# EAGLE design board exborgs baru (EAGLE 9.6.1)
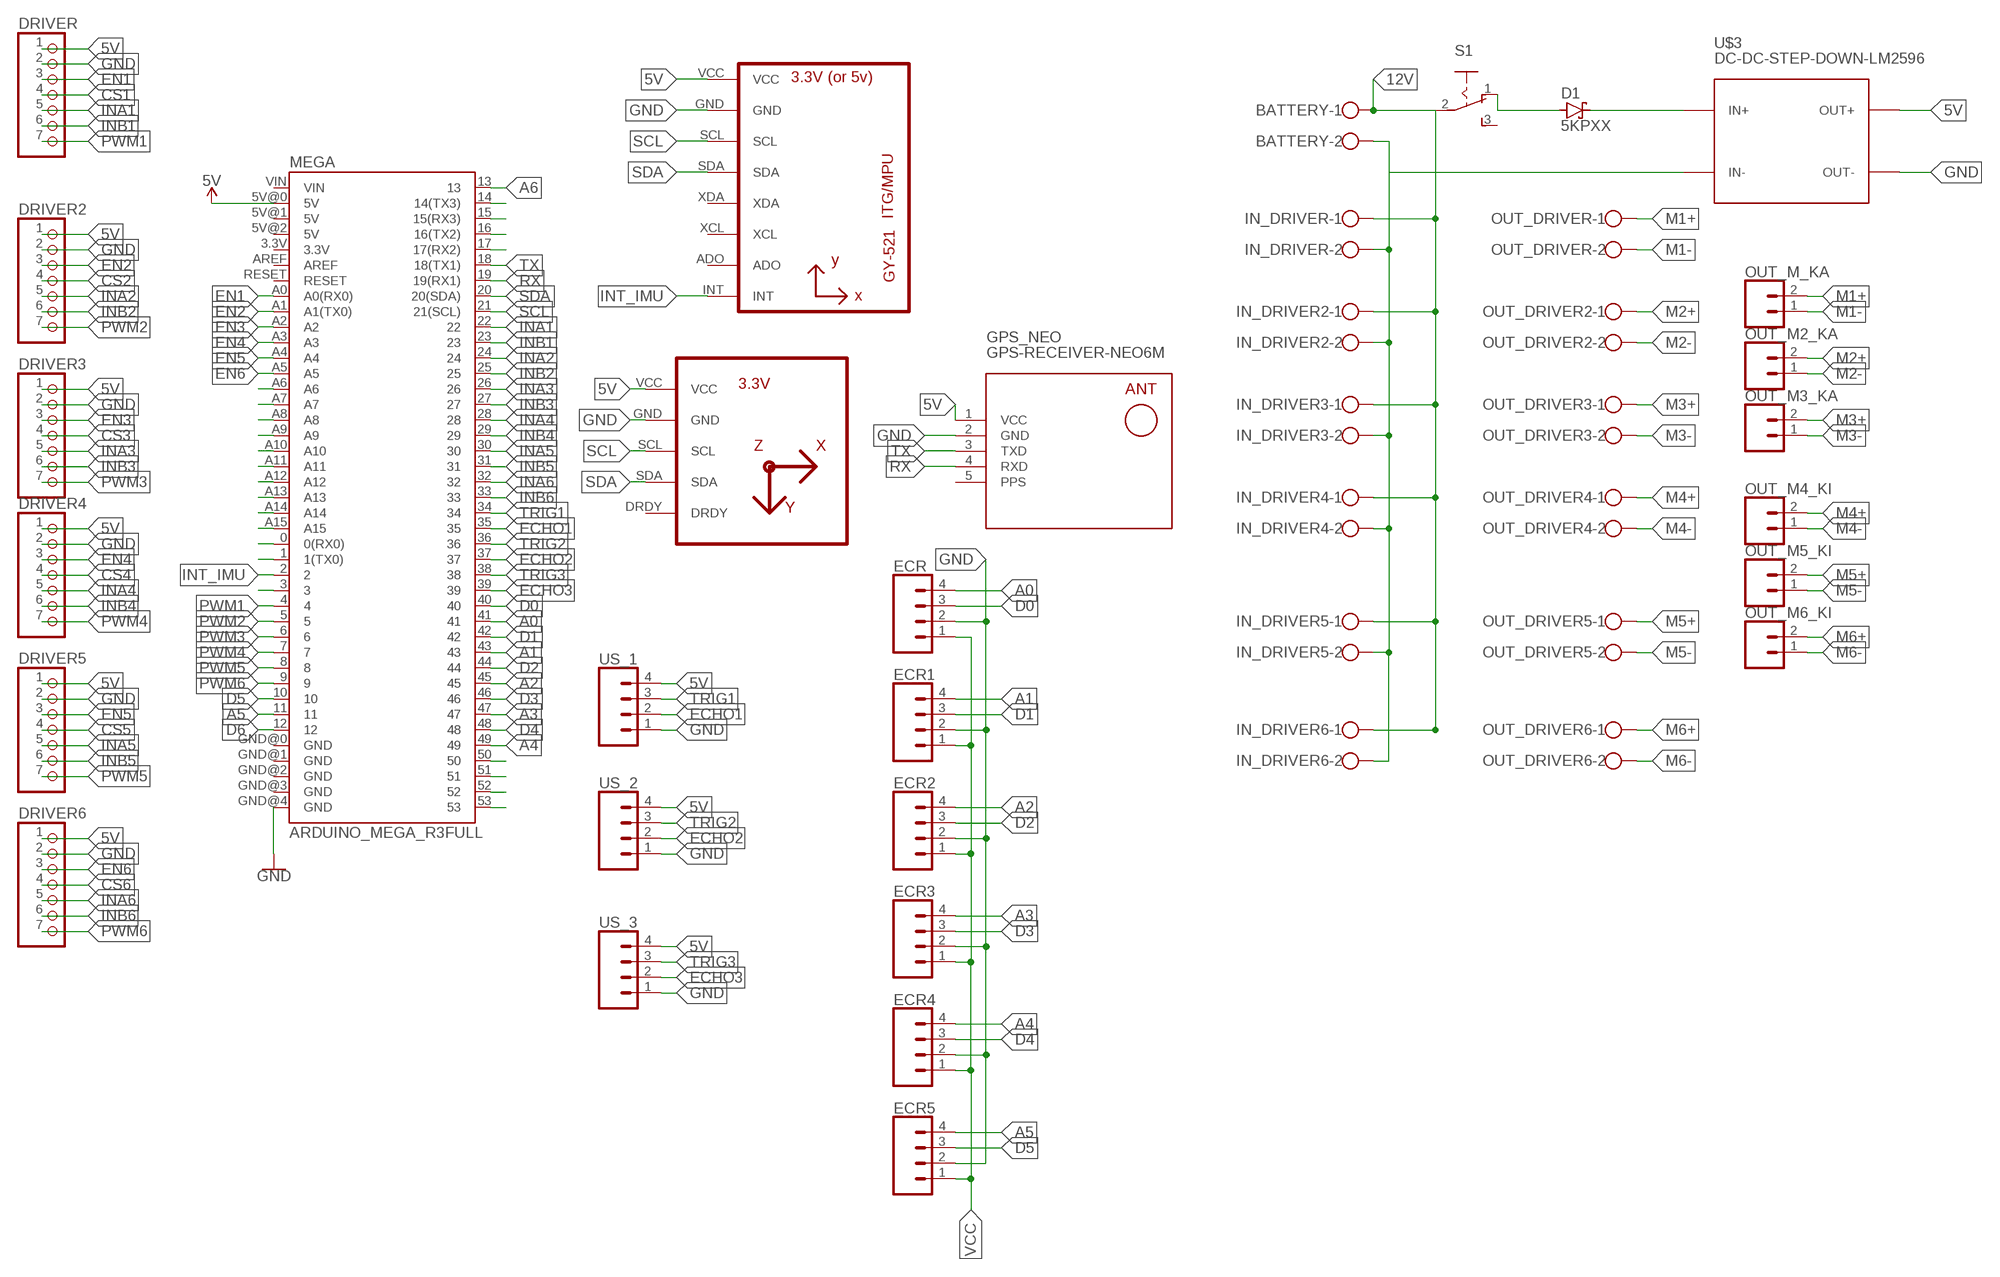
[diagram p0: schematic, sheet 1]

## Parts
BATTERY  W237-102  [W237-102]
D1  5KPXX  [P6T15]
DRIVER  PINHD-1X7  [1X07]
DRIVER2  PINHD-1X7  [1X07]
DRIVER3  PINHD-1X7  [1X07]
DRIVER4  PINHD-1X7  [1X07]
DRIVER5  PINHD-1X7  [1X07]
DRIVER6  PINHD-1X7  [1X07]
ECR  CONN_04POLAR  [MOLEX-1X4]
ECR1  CONN_04POLAR  [MOLEX-1X4]
ECR2  CONN_04POLAR  [MOLEX-1X4]
ECR3  CONN_04POLAR  [MOLEX-1X4]
ECR4  CONN_04POLAR  [MOLEX-1X4]
ECR5  CONN_04POLAR  [MOLEX-1X4]
GPS_NEO  GPS-RECEIVER-NEO6M  [GPS-RECEIVER-NEO6M]
IMU  GY-521MPU6050  [GY-521]
IN_DRIVER  W237-102  [W237-102]
IN_DRIVER2  W237-102  [W237-102]
IN_DRIVER3  W237-102  [W237-102]
IN_DRIVER4  W237-102  [W237-102]
IN_DRIVER5  W237-102  [W237-102]
IN_DRIVER6  W237-102  [W237-102]
KOMPAS  HMC5883LGY-271  [GY-271]
MEGA  ARDUINO_MEGA_R3FULL  [ARDUINO_MEGA]
OUT_DRIVER  W237-102  [W237-102]
OUT_DRIVER2  W237-102  [W237-102]
OUT_DRIVER3  W237-102  [W237-102]
OUT_DRIVER4  W237-102  [W237-102]
OUT_DRIVER5  W237-102  [W237-102]
OUT_DRIVER6  W237-102  [W237-102]
OUT_M2_KA  CONN_02POLAR  [MOLEX-1X2]
OUT_M3_KA  CONN_02POLAR  [MOLEX-1X2]
OUT_M4_KI  CONN_02POLAR  [MOLEX-1X2]
OUT_M5_KI  CONN_02POLAR  [MOLEX-1X2]
OUT_M6_KI  CONN_02POLAR  [MOLEX-1X2]
OUT_M_KA  CONN_02POLAR  [MOLEX-1X2]
S1  255SB  [255SB]
U$3  DC-DC-STEP-DOWN-LM2596  [DC-DC-STEP-DOWN-LM2596]
US_1  CONN_04POLAR  [MOLEX-1X4]
US_2  CONN_04POLAR  [MOLEX-1X4]
US_3  CONN_04POLAR  [MOLEX-1X4]

## Nets
5V: DRIVER2.1 DRIVER3.1 DRIVER4.1 DRIVER5.1 DRIVER6.1 DRIVER.1 GPS_NEO.1(VCC) IMU.VCC KOMPAS.VCC MEGA.5V@0(5V) U$3.OUT+ US_1.4 US_2.4 US_3.4
12V: BATTERY.1 IN_DRIVER2.1 IN_DRIVER3.1 IN_DRIVER4.1 IN_DRIVER5.1 IN_DRIVER6.1 IN_DRIVER.1 S1.2(P)
A0: ECR.4 MEGA.41
A1: ECR1.4 MEGA.43
A2: ECR2.4 MEGA.45
A3: ECR3.4 MEGA.47
A4: ECR4.4 MEGA.49
A5: ECR5.4 MEGA.11
A6: MEGA.13
CS1: DRIVER.4
CS2: DRIVER2.4
CS3: DRIVER3.4
CS4: DRIVER4.4
CS5: DRIVER5.4
CS6: DRIVER6.4
D0: ECR.3 MEGA.40
D1: ECR1.3 MEGA.42
D2: ECR2.3 MEGA.44
D3: ECR3.3 MEGA.46
D4: ECR4.3 MEGA.48
D5: ECR5.3 MEGA.10
D6: MEGA.12
ECHO1: MEGA.35 US_1.2
ECHO2: MEGA.37 US_2.2
ECHO3: MEGA.39 US_3.2
EN1: DRIVER.3 MEGA.A0(A0(RX0))
EN2: DRIVER2.3 MEGA.A1(A1(TX0))
EN3: DRIVER3.3 MEGA.A2
EN4: DRIVER4.3 MEGA.A3
EN5: DRIVER5.3 MEGA.A4
EN6: DRIVER6.3 MEGA.A5
GND: DRIVER2.2 DRIVER3.2 DRIVER4.2 DRIVER5.2 DRIVER6.2 DRIVER.2 ECR1.2 ECR2.2 ECR3.2 ECR4.2 ECR5.2 ECR.2 GPS_NEO.2(GND) IMU.GND KOMPAS.GND MEGA.GND@4(GND) U$3.OUT- US_1.1 US_2.1 US_3.1
INA1: DRIVER.5 MEGA.22
INA2: DRIVER2.5 MEGA.24
INA3: DRIVER3.5 MEGA.26
INA4: DRIVER4.5 MEGA.28
INA5: DRIVER5.5 MEGA.30
INA6: DRIVER6.5 MEGA.32
INB1: DRIVER.6 MEGA.23
INB2: DRIVER2.6 MEGA.25
INB3: DRIVER3.6 MEGA.27
INB4: DRIVER4.6 MEGA.29
INB5: DRIVER5.6 MEGA.31
INB6: DRIVER6.6 MEGA.33
INT_IMU: IMU.INT MEGA.2
M1+: OUT_DRIVER.1 OUT_M_KA.2
M1-: OUT_DRIVER.2 OUT_M_KA.1
M2+: OUT_DRIVER2.1 OUT_M2_KA.2
M2-: OUT_DRIVER2.2 OUT_M2_KA.1
M3+: OUT_DRIVER3.1 OUT_M3_KA.2
M3-: OUT_DRIVER3.2 OUT_M3_KA.1
M4+: OUT_DRIVER4.1 OUT_M4_KI.2
M4-: OUT_DRIVER4.2 OUT_M4_KI.1
M5+: OUT_DRIVER5.1 OUT_M5_KI.2
M5-: OUT_DRIVER5.2 OUT_M5_KI.1
M6+: OUT_DRIVER6.1 OUT_M6_KI.2
M6-: OUT_DRIVER6.2 OUT_M6_KI.1
N$1: MEGA.A6
N$2: D1.A S1.1(O)
N$3: D1.C U$3.IN+
N$4: BATTERY.2 IN_DRIVER2.2 IN_DRIVER3.2 IN_DRIVER4.2 IN_DRIVER5.2 IN_DRIVER6.2 IN_DRIVER.2 U$3.IN-
N$5: MEGA.A8
N$6: MEGA.A9
N$7: MEGA.A10
N$8: MEGA.A11
N$9: MEGA.A12
N$10: MEGA.A13
N$11: MEGA.A7
N$12: MEGA.A14
N$13: MEGA.A15
N$14: MEGA.0(0(RX0))
N$15: MEGA.1(1(TX0))
N$17: MEGA.3
N$28: MEGA.14(14(TX3))
N$29: MEGA.15(15(RX3))
N$30: MEGA.16(16(TX2))
N$31: MEGA.17(17(RX2))
N$62: MEGA.50
N$63: MEGA.51
N$64: MEGA.52
N$65: MEGA.53
PWM1: DRIVER.7 MEGA.4
PWM2: DRIVER2.7 MEGA.5
PWM3: DRIVER3.7 MEGA.6
PWM4: DRIVER4.7 MEGA.7
PWM5: DRIVER5.7 MEGA.8
PWM6: DRIVER6.7 MEGA.9
RX: GPS_NEO.4(RXD) MEGA.19(19(RX1))
SCL: IMU.SCL KOMPAS.SCL MEGA.21(21(SCL))
SDA: IMU.SDA KOMPAS.SDA MEGA.20(20(SDA))
TRIG1: MEGA.34 US_1.3
TRIG2: MEGA.36 US_2.3
TRIG3: MEGA.38 US_3.3
TX: GPS_NEO.3(TXD) MEGA.18(18(TX1))
VCC: ECR1.1 ECR2.1 ECR3.1 ECR4.1 ECR5.1 ECR.1
Unconnected: IMU.ADO IMU.XCL IMU.XDA KOMPAS.DRDY MEGA.3.3V MEGA.5V@1(5V) MEGA.5V@2(5V) MEGA.AREF MEGA.GND@0(GND) MEGA.GND@1(GND) MEGA.GND@2(GND) MEGA.GND@3(GND) MEGA.RESET MEGA.VIN S1.3(S)

## Power pins joined to a net without a drawn wire
PPS: GPS_NEO.5(PPS)

## Library data of the parts
BATTERY IN_DRIVER IN_DRIVER2-IN_DRIVER6 OUT_DRIVER OUT_DRIVER2-OUT_DRIVER6 = con-wago-500:W237-102: WAGO SCREW CLAMP; MPN: 237-102; OC_FARNELL: unknown; OC_NEWARK: 70K9898
D1 = diode:5KPXX: DIODE transient voltage suppressor
DRIVER DRIVER2-DRIVER6 = pinhead:PINHD-1X7: PIN HEADER
ECR ECR1-ECR5 US_1-US_3 = SparkFun-Connectors:CONN_04: Multi connection point. Often used as Generic Header-pin footprint for 0.1 inch spaced/style header connections On any of the 0.1 inch spaced packages, you can populate with these: Break Away Headers - Straight <https://www.sparkfun.com/products/116> (PRT-00116) Break Away Male Headers - Right Angle <https://www.sparkfun.com/products/553> (PRT-00553) Female Headers <https://www.sparkfun.com/products/115> (PRT-00115) Break Away Headers - Machine Pin <https://www.sparkfun.com/products/117> (PRT-00117) Break Away Female Headers - Swiss Machine Pin <https://www.sparkfun.com/products/743> (PRT-00743) For SCREWTERMINALS and SPRING TERMINALS visit here: Screw Terimnals on SparkFun.com <https://www.sparkfun.com/search/results?term=Screw+Terminals> (5mm/3.5mm/2.54mm spacing) This device is also useful as a general connection point to wire up your design to another part of your project. Our various solder wires solder well into these plated through hole pads. Hook-Up Wire - Assortment (Stranded, 22 AWG) <https://www.sparkfun.com/products/11375> (PRT-11375) Hook-Up Wire - Assortment (Solid Core, 22 AWG) <https://www.sparkfun.com/products/11367> (PRT-11367) View the entire wire category on our website here <https://www.sparkfun.com/categories/141> Special notes: Molex polarized connector foot print use with SKU : PRT-08231 with associated crimp pins and housings. 1MM SMD Version SKU: PRT-10208; PROD_ID: CONN-08186; SF_ID: PRT-08231
GPS_NEO = diy-modules:GPS-RECEIVER-NEO6M: GPS Receiver Module based on NEO-6 device Short tutorial how to use NEO-6 module with Arduino: http://www.xarg.org/2016/06/neo6mv2-gps-module-with-arduino/ NEO-6 datasheet is available here: https://www.u-blox.com/sites/default/files/products/documents/NEO-6_DataSheet_%28GPS.G6-HW-09005%29.pdf Click here to find device on ebay.com <http://www.ebay.com/sch/gyneo6mv2>
IMU = gy-521:GY-521
KOMPAS = hmc5883l:HMC5883L
MEGA = SparkFun-Boards:ARDUINO_MEGA_R3: Arduino Mega R3 ATmega2560 R3 compatible footprint. SparkFun Products: Arduino Mega 2560 R3 <https://www.sparkfun.com/products/11061>
OUT_M2_KA OUT_M3_KA OUT_M4_KI OUT_M5_KI OUT_M6_KI OUT_M_KA = SparkFun-Connectors:CONN_02: Multi connection point. Often used as Generic Header-pin footprint for 0.1 inch spaced/style header connections On any of the 0.1 inch spaced packages, you can populate with these: Break Away Headers - Straight <https://www.sparkfun.com/products/116> (PRT-00116) Break Away Male Headers - Right Angle <https://www.sparkfun.com/products/553> (PRT-00553) Female Headers <https://www.sparkfun.com/products/115> (PRT-00115) Break Away Headers - Machine Pin <https://www.sparkfun.com/products/117> (PRT-00117) Break Away Female Headers - Swiss Machine Pin <https://www.sparkfun.com/products/743> (PRT-00743) For SCREWTERMINALS and SPRING TERMINALS visit here: Screw Terimnals on SparkFun.com <https://www.sparkfun.com/search/results?term=Screw+Terminals> (5mm/3.5mm/2.54mm spacing) This device is also useful as a general connection point to wire up your design to another part of your project. Our various solder wires solder well into these plated through hole pads. Hook-Up Wire - Assortment (Stranded, 22 AWG) <https://www.sparkfun.com/products/11375> (PRT-11375) Hook-Up Wire - Assortment (Solid Core, 22 AWG) <https://www.sparkfun.com/products/11367> (PRT-11367) View the entire wire category on our website here <https://www.sparkfun.com/categories/141> Special notes: Molex polarized connector foot print use with: PRT-08233 with associated crimp pins and housings. 2.54_SCREWTERM for use with PRT-10571. 3.5mm Screw Terminal footprints for PRT-08084 5mm Screw Terminal footprints for use with PRT-08432; SF_ID: PRT-09918
S1 = switch:255SB: SLIDING SWITCH Distributor Buerklin, 11G810
U$3 = diy-modules:DC-DC-STEP-DOWN-LM2596: DC/DC Step-Down Regulator based on LM2596-ADJ chip LM2596 datasheet available here: http://www.ti.com/lit/ds/symlink/lm2596.pdf Click here to find device on ebay.com <http://www.ebay.com/sch/lm2596+power+regulator>

## Net classes
0 default: clearance 0.205 mm

## Board
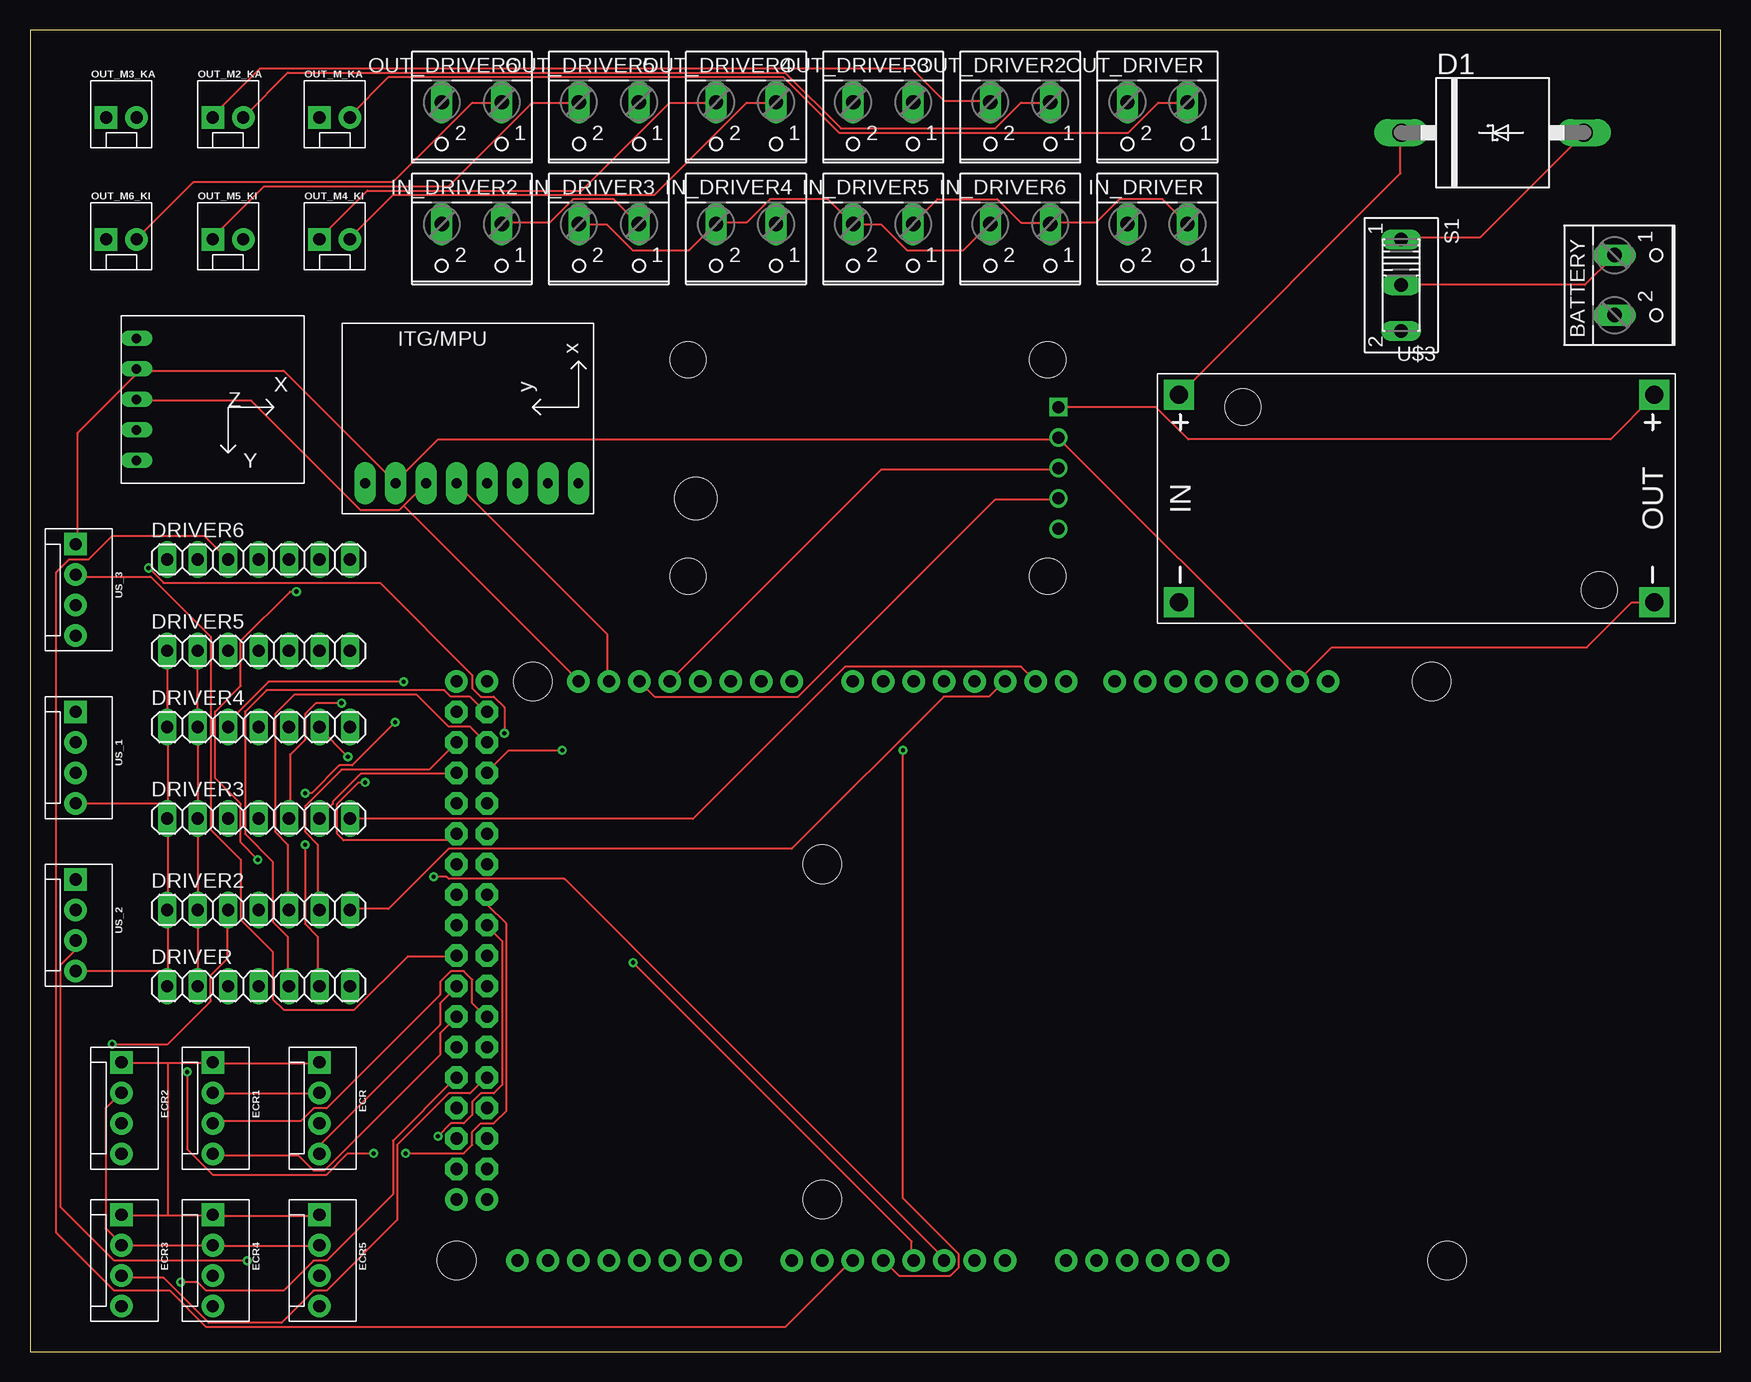
[diagram p1: board, top side]
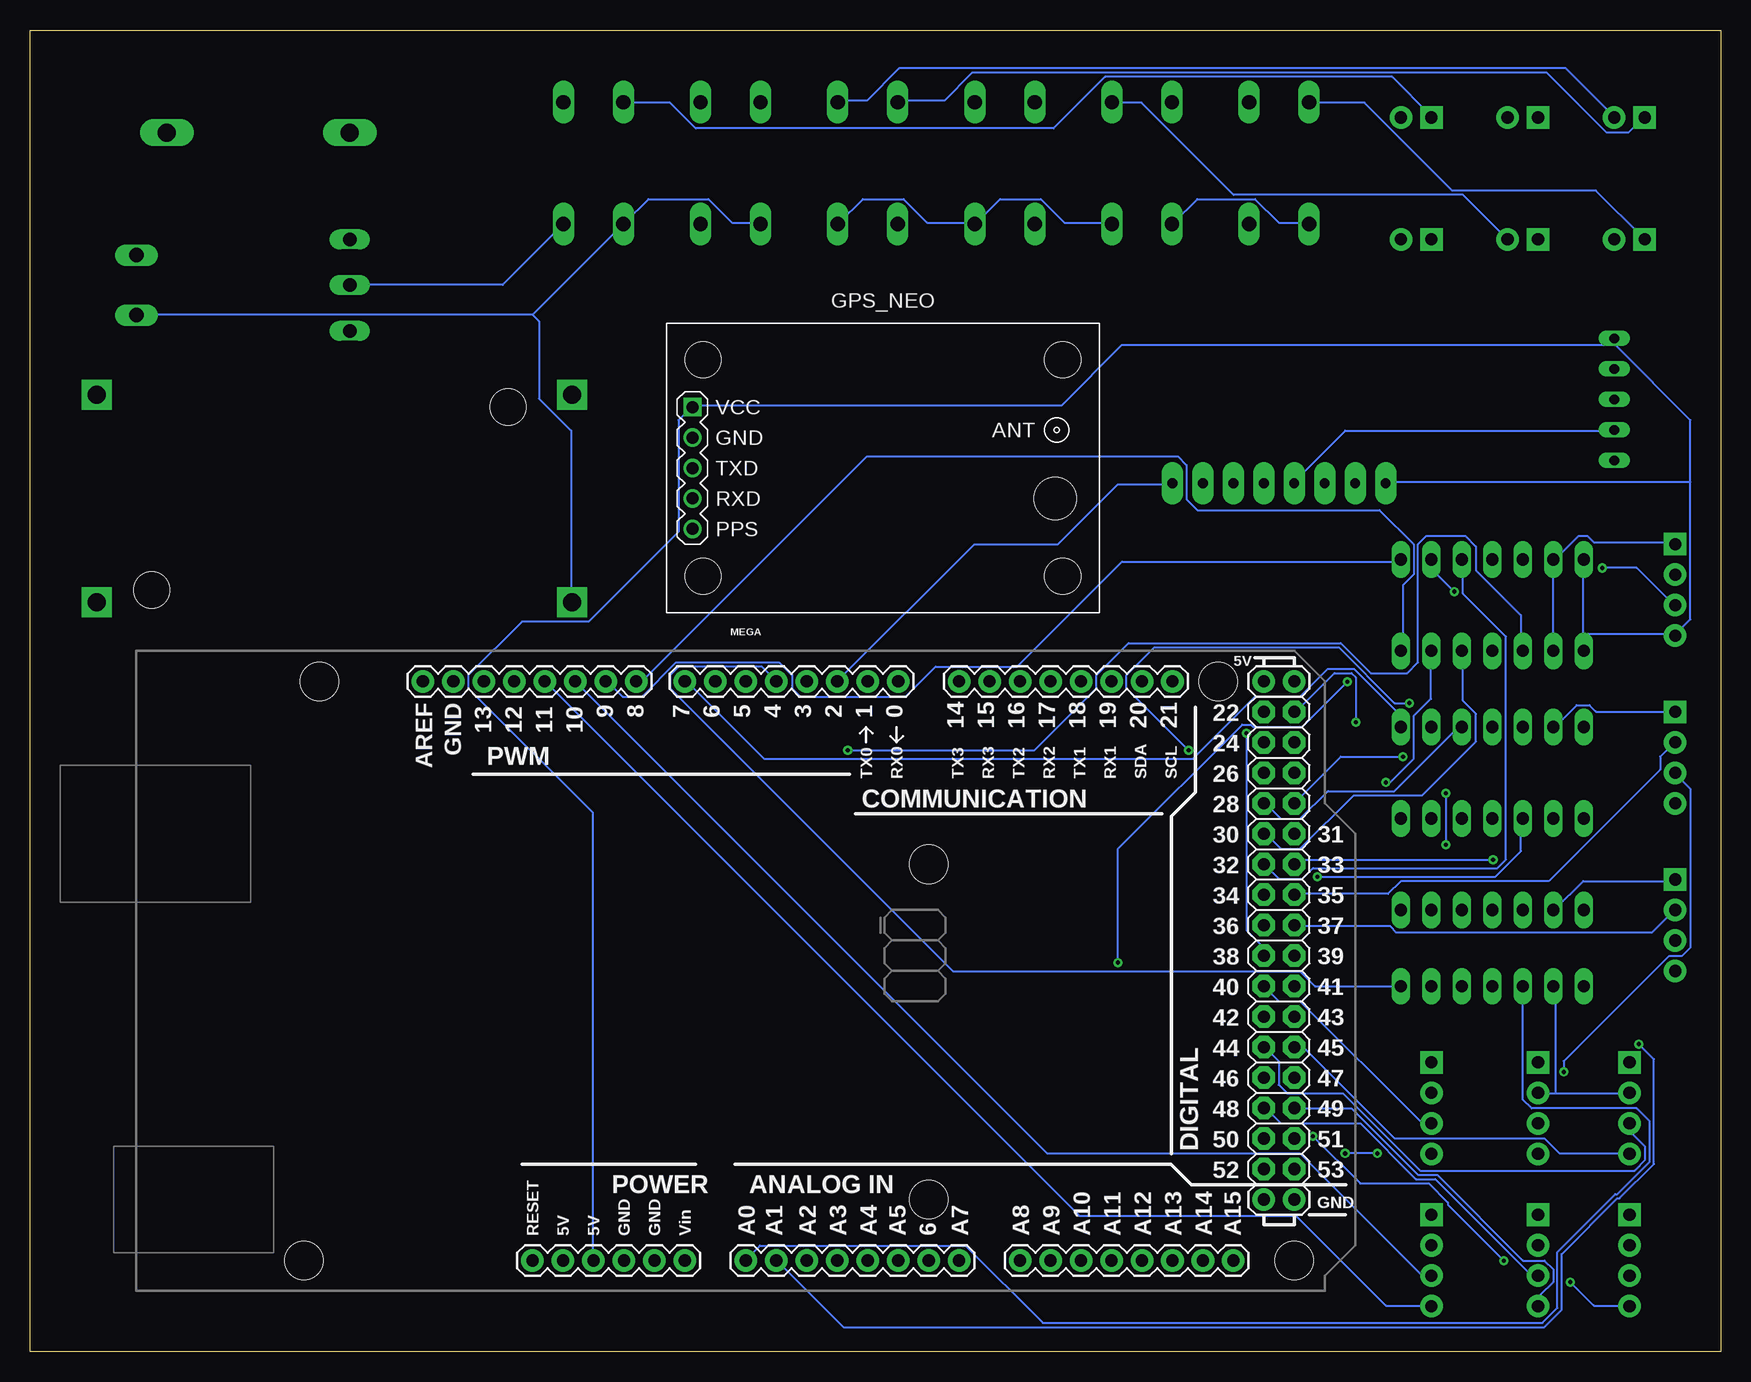
[diagram p2: board, bottom side, seen from below]

Size 140.95 x 110.16 mm. Coordinates in mm from the lower left corner, seen from the top.
Outline: 0,0 140.95,0 140.95,110.16 0,110.16 0,0
Copper layers (1*16): Top 0.035mm / dielectric 1.5mm / Bottom 0.035mm
Design rules "default": minimum track width 6mil, minimum drill 0.35mm, track to track 6mil, track to pad 6mil, pad to pad 6mil, via to via 6mil, smd to smd 6mil, copper to edge 40mil, drill to drill 6mil, minimum pad ring 10mil, minimum via ring 8mil, stop-mask expansion 4mil, vias tented up to drill 0mil, thermal gap 10mil

### Footprints (pad centres in the part's own frame; a part is rotated, then mirrored left to right if it is on the bottom)
W237-102 = drill 1.194 long: 1 -2.5,-1.27; 2 2.5,-1.27
P6T15 = drill 1.499 long: A 7.62,0; C -7.62,0
1X07 = drill 1.016 long: 1 -7.62,0; 2 -5.08,0; 3 -2.54,0; 4 0,0; 5 2.54,0; 6 5.08,0; 7 7.62,0
MOLEX-1X4 = drill 1.016 pad 1.88 square: 1 0,0 | drill 1.016 pad 1.88: 2 2.54,0; 3 5.08,0; 4 7.62,0
GPS-RECEIVER-NEO6M = drill 1 square: 1 -15.875,5.08 | drill 1: 2 -15.875,2.54; 3 -15.875,0; 4 -15.875,-2.54; 5 -15.875,-5.08 | hole 3: -14.986,9.017; -14.986,-9.017; 14.986,-9.017; 14.986,9.017 | hole 3.5: 14.351,-2.54
GY-521 = drill 0.8 pad 1.778 long: ADO -8.89,-6.35; GND -8.89,6.35; INT -8.89,-8.89; SCL -8.89,3.81; SDA -8.89,1.27; VCC -8.89,8.89; XCL -8.89,-3.81; XDA -8.89,-1.27
GY-271 = drill 0.8 long: DRDY -6.35,-4.445; GND -6.35,3.175; SCL -6.35,0.635; SDA -6.35,-1.905; VCC -6.35,5.715
ARDUINO_MEGA = drill 1.016 pad 1.88: 0 13.97,24.13; 1 11.43,24.13; 2 8.89,24.13; 3 6.35,24.13; 3.3V -13.97,-24.13; 4 3.81,24.13; 5 1.27,24.13; 5V@0 -11.43,-24.13; 5V@1 44.45,24.13; 5V@2 46.99,24.13; 6 -1.27,24.13; 7 -3.81,24.13; 8 -7.874,24.13; 9 -10.414,24.13; 10 -12.954,24.13; 11 -15.494,24.13; 12 -18.034,24.13; 13 -20.574,24.13; 14 19.05,24.13; 15 21.59,24.13; 16 24.13,24.13; 17 26.67,24.13; 18 29.21,24.13; 19 31.75,24.13; 20 34.29,24.13; 21 36.83,24.13; A0 1.27,-24.13; A1 3.81,-24.13; A2 6.35,-24.13; A3 8.89,-24.13; A4 11.43,-24.13; A5 13.97,-24.13; A6 16.51,-24.13; A7 19.05,-24.13; A8 24.13,-24.13; A9 26.67,-24.13; A10 29.21,-24.13; A11 31.75,-24.13; A12 34.29,-24.13; A13 36.83,-24.13; A14 39.37,-24.13; A15 41.91,-24.13; AREF -25.654,24.13; GND@0 -8.89,-24.13; GND@1 -6.35,-24.13; GND@2 44.45,-19.05; GND@3 46.99,-19.05; GND@4 -23.114,24.13; RESET -16.51,-24.13; VIN -3.81,-24.13 | drill 1.016 pad 1.88 octagon: 22 44.45,21.59; 23 46.99,21.59; 24 44.45,19.05; 25 46.99,19.05; 26 44.45,16.51; 27 46.99,16.51; 28 44.45,13.97; 29 46.99,13.97; 30 44.45,11.43; 31 46.99,11.43; 32 44.45,8.89; 33 46.99,8.89; 34 44.45,6.35; 35 46.99,6.35; 36 44.45,3.81; 37 46.99,3.81; 38 44.45,1.27; 39 46.99,1.27; 40 44.45,-1.27; 41 46.99,-1.27; 42 44.45,-3.81; 43 46.99,-3.81; 44 44.45,-6.35; 45 46.99,-6.35; 46 44.45,-8.89; 47 46.99,-8.89; 48 44.45,-11.43; 49 46.99,-11.43; 50 44.45,-13.97; 51 46.99,-13.97; 52 44.45,-16.51; 53 46.99,-16.51 | hole 3.2: -34.29,24.13; -35.56,-24.13; 16.51,8.89; 16.51,-19.05; 40.64,24.13; 46.99,-24.13
MOLEX-1X2 = drill 1.016 pad 1.88 square: 1 0,0 | drill 1.016 pad 1.88: 2 2.54,0
255SB = drill 1.118 long: 1 -3.81,0; 2 0,0; 3 3.81,0
DC-DC-STEP-DOWN-LM2596 = drill 1.5 pad 2.5 square: IN+ -19.812,8.636; IN- -19.812,-8.636; OUT+ 19.812,8.636; OUT- 19.812,-8.636 | hole 3: -14.478,7.62; 15.24,-7.62

### Placement (x,y rotation side)
BATTERY  133.35,88.9 270 top
D1  121.92,101.6 0 top
DRIVER  19.05,30.48 0 top
DRIVER2  19.05,36.83 0 top
DRIVER3  19.05,44.45 0 top
DRIVER4  19.05,52.07 0 top
DRIVER5  19.05,58.42 0 top
DRIVER6  19.05,66.04 0 top
ECR  24.13,24.13 270 top
ECR1  15.24,24.13 270 top
ECR2  7.62,24.13 270 top
ECR3  7.62,11.43 270 top
ECR4  15.24,11.43 270 top
ECR5  24.13,11.43 270 top
GPS_NEO  69.85,73.66 0 bottom
IMU  36.83,81.28 90 top
IN_DRIVER  93.98,92.71 180 top
IN_DRIVER2  36.83,92.71 180 top
IN_DRIVER3  48.26,92.71 180 top
IN_DRIVER4  59.69,92.71 180 top
IN_DRIVER5  71.12,92.71 180 top
IN_DRIVER6  82.55,92.71 180 top
KOMPAS  15.24,78.74 0 top
MEGA  82.55,31.75 0 bottom
OUT_DRIVER  93.98,102.87 180 top
OUT_DRIVER2  82.55,102.87 180 top
OUT_DRIVER3  71.12,102.87 180 top
OUT_DRIVER4  59.69,102.87 180 top
OUT_DRIVER5  48.26,102.87 180 top
OUT_DRIVER6  36.83,102.87 180 top
OUT_M2_KA  15.24,102.87 0 top
OUT_M3_KA  6.35,102.87 0 top
OUT_M4_KI  24.13,92.71 0 top
OUT_M5_KI  15.24,92.71 0 top
OUT_M6_KI  6.35,92.71 0 top
OUT_M_KA  24.13,102.87 0 top
S1  114.3,88.9 270 top
U$3  115.57,71.12 0 top
US_1  3.81,53.34 270 top
US_2  3.81,39.37 270 top
US_3  3.81,67.31 270 top

### Tracks (layer width: path | path; a pad name or v marks a point on that pad's centre or on a via)
5V
  Top 0.152: 11.49,31.73 11.49,36.74 DRIVER2.1 11.49,36.91 11.49,44.42 DRIVER3.1 | 11.49,31.73 11.49,30.48 DRIVER.1 11.49,31.73 | 11.49,31.73 3.98,31.73 US_2.4 | 11.49,45.67 11.49,51.93 DRIVER4.1 11.49,52.1 11.49,58.36 DRIVER5.1 | 11.49,45.67 11.49,44.6 DRIVER3.1 | 11.49,45.67 3.98,45.67 US_1.4 | 11.49,45.67 DRIVER3.1 | GPS_NEO.1 85.83,78.73 93.87,78.73 96.55,76.05 131.75,76.05 135.33,79.62 U$3.OUT+
  Bottom 0.152: 11.49,59.79 11.49,58.54 DRIVER5.1 11.49,59.79 | 11.49,59.79 11.49,65.86 DRIVER6.1 | 8.81,83.91 8.81,84.45 KOMPAS.VCC 8.81,83.91 | 8.81,83.91 2.55,77.66 2.55,72.48 | 2.55,72.48 2.55,61.04 3.8,59.79 US_3.4 3.98,59.79 11.49,59.79 | 2.55,72.48 27.93,72.48 IMU.VCC | MEGA.5V@0 94.05,7.79 94.05,44.96 104.41,55.32 104.41,56.39 99.94,60.86 94.41,60.86 86.9,68.37 86.9,77.66 85.83,78.73 GPS_NEO.1 85.65,78.91 54.91,78.91 49.91,83.91 8.81,83.91
12V
  Top 0.152: S1.2 114.42,88.92 129.61,88.92 131.93,91.24 BATTERY.1 | IN_DRIVER.1 96.37,94.1 94.41,96.06 90.83,96.06 88.87,94.1 85.11,94.1 IN_DRIVER6.1 84.93,94.1 82.61,94.1 80.65,96.06 75.64,96.06 73.68,94.1 IN_DRIVER5.1 | IN_DRIVER2.1 39.37,94.1 43.3,94.1 45.26,96.06 48.66,96.06 50.62,94.1 IN_DRIVER3.1
  Bottom 0.152: IN_DRIVER5.1 73.5,94.1 71.53,96.06 68.14,96.06 66.17,94.1 62.24,94.1 IN_DRIVER4.1 62.06,94.1 60.1,96.06 56.7,96.06 54.73,94.1 50.8,94.1 IN_DRIVER3.1 | S1.2 114.24,88.92 101.55,88.92 96.55,93.92 IN_DRIVER.1
A0
  Top 0.152: ECR.4 24.18,16.54 24.18,17.26 34.18,27.27 34.18,29.05 35.43,30.3 MEGA.41
A1
  Top 0.152: ECR1.4 15.24,16.36 22.39,16.36 23.64,15.11 24.53,15.11 34.18,24.76 34.18,26.55 35.43,27.8 MEGA.43
A2
  Bottom 0.152: ECR2.4 7.74,16.54 13.45,16.54 14.7,17.79 27.21,17.79 34.72,25.3 35.43,25.3 MEGA.45
A3  (via drill 0.35)
  Top 0.152: v12.56,5.82 13.99,5.82 14.7,5.11 21.14,5.11 23.64,7.61 24.71,7.61 30.25,13.15 30.25,17.62 35.43,22.8 MEGA.47
  Bottom 0.152: v12.56,5.82 10.59,3.86 7.74,3.86 ECR3.4
A4
  Bottom 0.152: ECR4.4 15.06,3.86 15.06,4.75 13.99,5.82 13.99,6.89 14.7,7.61 16.49,7.61 23.64,14.76 25.25,14.76 30.79,20.3 35.43,20.3 MEGA.49
A5
  Bottom 0.152: ECR5.4 24.18,3.86 27.93,3.86 35.43,11.36 53.48,11.36 97.98,55.86 MEGA.11
D0
  Bottom 0.152: ECR.3 24.18,19.22 25.07,19.22 35.08,29.23 36.86,29.23 37.94,30.3 MEGA.40
D1
  Top 0.152: ECR1.3 15.24,19.22 22.57,19.22 23.64,20.3 24.71,20.3 34.18,29.77 34.18,30.84 35.08,31.73 36.15,31.73 36.86,31.02 36.86,29.05 37.94,27.98 MEGA.42
D2
  Bottom 0.152: ECR2.3 7.56,19.05 7.56,18.33 6.31,17.08 6.31,16.01 7.2,15.11 25.07,15.11 31.5,21.55 36.15,21.55 36.86,22.26 36.86,24.23 37.94,25.3 MEGA.44
D3
  Top 0.152: ECR3.3 7.74,6.18 11.13,6.18 14.88,2.42 20.96,2.42 23.64,5.11 24.71,5.11 30.61,11 30.61,17.26 34.9,21.55 36.69,21.55 37.94,22.8 MEGA.46
D4
  Bottom 0.152: ECR4.3 15.78,6.36 23.82,14.4 25.43,14.4 30.07,19.05 36.69,19.05 37.94,20.3 MEGA.48
D5
  Bottom 0.152: ECR5.3 24.18,6.36 24.89,6.36 35.08,16.54 56.16,16.54 95.48,55.86 MEGA.10
ECHO1
  Bottom 0.152: MEGA.35 35.43,38.16 27.75,38.16 26.68,39.24 14.35,39.24 5.05,48.53 5.05,49.6 3.98,50.67 US_1.2
ECHO2
  Bottom 0.152: MEGA.37 35.43,35.48 27.57,35.48 27.03,34.95 5.77,34.95 3.98,36.74 US_2.2
ECHO3
  Top 0.152: MEGA.39 35.43,32.98 31.5,32.98 27.03,28.52 21.14,28.52 20.24,29.41 20.24,33.34 17.56,36.02 17.56,41.02 15.06,43.53 15.06,59.61 10.06,64.61 3.98,64.61 US_3.2
EN1
  Bottom 0.152: DRIVER.3 16.49,30.3 16.49,21.01 15.78,20.3 7.02,20.3 5.95,19.22 5.95,15.83 8.63,13.15 8.81,13.15 13.63,8.32 13.63,3.68 14.88,2.42 56.52,2.42 62.95,8.86 80.11,8.86 81.18,7.79 MEGA.A0
EN2  (via drill 0.35)
  Top 0.152: v6.84,25.66 11.49,25.66 15.06,29.23 15.06,31.38 16.49,32.8 16.49,36.74 DRIVER2.3
  Bottom 0.152: v6.84,25.66 5.59,24.41 5.59,15.65 8.45,12.79 8.63,12.79 13.28,8.14 13.28,3.5 14.7,2.07 73.14,2.07 78.68,7.61 MEGA.A1
EN3  (via drill 0.35)
  Top 0.152: v33.65,39.59 34.72,39.59 34.9,39.42 44.55,39.42 76.18,7.79 MEGA.A2
  Bottom 0.152: v33.65,39.59 18.81,39.59 16.67,41.74 16.67,44.42 DRIVER3.3
EN4  (via drill 0.35)
  Top 0.152: v31.15,55.86 19.89,55.86 16.67,52.64 16.67,52.1 DRIVER4.3 | v50.27,32.45 73.5,9.22 73.5,7.79 MEGA.A3
  Bottom 0.152: v31.15,55.86 34.9,52.1 39.01,52.1 39.19,52.28 39.9,52.28 50.27,41.92 v50.27,32.45
EN5  (via drill 0.35)
  Top 0.152: v72.78,50.14 72.78,12.79 77.43,8.14 77.43,7.07 76.71,6.36 72.43,6.36 71.17,7.61 MEGA.A4
  Bottom 0.152: v72.78,50.14 57.24,50.14 52.05,55.32 52.05,56.39 49.37,59.07 31.68,59.07 29.18,56.57 26.14,56.57 25.25,57.47 25.25,67.29 24.53,68.01 21.32,68.01 20.42,67.11 20.42,65.15 16.67,61.4 16.67,58.54 DRIVER5.3
EN6
  Top 0.152: DRIVER6.3 16.49,66.04 14.53,68.01 6.84,68.01 4.88,66.04 3.27,66.04 2.2,64.97 2.2,9.93 7.02,5.11 11.67,5.11 14.7,2.07 62.95,2.07 68.49,7.61 MEGA.A5
GND
  Top 0.152: 105.84,56.04 85.83,76.05 GPS_NEO.2 85.65,76.05 34.01,76.05 30.43,72.48 | 105.84,56.04 108.52,58.72 129.79,58.72 133.54,62.47 135.33,62.47 U$3.OUT- | 105.84,56.04 MEGA.GND@4 | US_3.1 3.98,67.47 3.98,76.59 8.81,81.41 8.81,81.77 KOMPAS.GND 8.99,81.77 21.14,81.77 30.43,72.48 | ECR5.2 24,8.86 15.24,8.86 ECR4.2 15.06,8.86 7.74,8.86 ECR3.2 7.56,9.04 6.31,10.29 6.31,20.3 7.56,21.55 ECR2.2 | ECR.2 24,21.55 15.24,21.55 ECR1.2 | DRIVER.2 13.99,30.48 13.99,36.74 DRIVER2.2 13.99,36.91 13.99,44.42 DRIVER3.2 13.99,44.6 13.99,51.93 DRIVER4.2 13.99,52.1 13.99,58.36 DRIVER5.2 | 30.43,72.48 IMU.GND
  Bottom 0.152: 13.81,21.55 15.06,21.55 ECR1.2 | 13.81,21.55 7.74,21.55 ECR2.2 | US_2.1 3.98,39.24 11.49,39.24 13.81,36.91 DRIVER2.2 | DRIVER5.2 13.99,58.54 13.99,65.86 DRIVER6.2 13.81,66.04 11.85,68.01 11.13,68.01 10.59,67.47 3.98,67.47 US_3.1 | US_1.1 3.98,53.36 10.42,53.36 10.95,53.89 12.02,53.89 13.81,52.1 DRIVER4.2 | 13.81,21.55 13.81,30.3 DRIVER.2
INA1
  Top 0.152: DRIVER.5 21.5,30.48 21.5,34.59 20.24,35.84 20.24,40.85 17.92,43.17 17.92,53.36 19.71,55.14 34.54,55.14 35.08,54.61 36.69,54.61 37.94,53.36 MEGA.22
INA2
  Top 0.152: DRIVER2.5 21.5,36.91 21.5,42.27 20.42,43.35 20.42,53.18 22.03,54.78 32.22,54.78 34.9,52.1 36.69,52.1 37.94,50.85 MEGA.24
INA3  (via drill 0.35)
  Top 0.152: v25.96,54.07 23.82,54.07 22.92,53.18 22.92,51.03 21.67,49.78 21.67,44.6 DRIVER3.5 | v44.37,50.14 39.9,50.14 38.12,48.35 MEGA.26
  Bottom 0.152: v25.96,54.07 27.21,54.07 31.86,58.72 47.23,58.72 49.55,56.39 49.55,55.32 v44.37,50.14
INA4
  Bottom 0.152: DRIVER4.5 21.67,51.93 22.03,51.93 27.21,46.74 32.75,46.74 35.08,44.42 36.69,44.42 37.94,45.67 MEGA.28
INA5
  Bottom 0.152: DRIVER5.5 21.5,58.36 21.5,54.25 20.42,53.18 20.42,50.85 24.89,46.39 30.61,46.39 35.08,41.92 36.69,41.92 37.94,43.17 MEGA.30
INA6
  Bottom 0.152: DRIVER6.5 21.5,65.86 21.5,63.18 17.92,59.61 17.92,41.02 18.64,40.31 34.01,40.31 34.9,39.42 36.86,39.42 37.94,40.49 MEGA.32
INB1  (via drill 0.35)
  Top 0.152: v22.92,42.27 22.92,35.66 24,34.59 24,30.48 DRIVER.6 | v22.92,46.56 23.46,46.56 25.78,48.89 26.86,48.89 v30.43,52.46
  Bottom 0.152: v22.92,46.56 v22.92,42.27 | v30.43,52.46 30.43,56.21 30.79,56.57 32.22,56.57 35.43,53.36 MEGA.23
INB2
  Top 0.152: MEGA.25 33.29,48.53 25.96,48.53 22.92,45.49 22.92,43.35 24,42.27 24,36.91 DRIVER2.6
INB3
  Top 0.152: DRIVER3.6 24.18,44.6 25.25,45.67 25.25,45.85 27.57,48.17 35.43,48.17 MEGA.27
INB4  (via drill 0.35)
  Top 0.152: v26.5,49.6 24.18,51.93 DRIVER4.6
  Bottom 0.152: v26.5,49.6 31.68,49.6 35.43,45.85 MEGA.29
INB5  (via drill 0.35)
  Top 0.152: v27.93,47.46 27.39,47.46 25.61,45.67 25.61,43.17 26.14,42.63 34.9,42.63 35.43,43.17 MEGA.31
  Bottom 0.152: v27.93,47.46 27.57,47.46 25.61,49.42 25.61,53 24.18,54.43 24.18,58.36 DRIVER5.6
INB6  (via drill 0.35)
  Top 0.152: v22.21,63.36 21.67,63.36 17.56,59.25 17.56,55.5 15.42,53.36 15.42,47.82 17.56,45.67 17.56,42.45 v18.99,41.02
  Bottom 0.152: v22.21,63.36 24,65.15 24,65.86 DRIVER6.6 | v18.99,41.02 35.08,41.02 35.43,40.67 MEGA.33
INT_IMU
  Bottom 0.152: IMU.INT 45.8,72.3 50.27,72.3 55.27,67.29 62.24,67.29 73.5,56.04 MEGA.2
M1+
  Top 0.152: OUT_DRIVER.1 96.37,104.11 94.05,104.11 91.55,101.6 67.42,101.6 62.78,106.25 29.9,106.25 26.68,103.03 OUT_M_KA.2
M1-
  Bottom 0.152: OUT_DRIVER.2 91.37,104.11 87.62,104.11 85.47,101.96 55.63,101.96 51.34,106.25 27.39,106.25 24.18,103.03 OUT_M_KA.1
M2+
  Top 0.152: OUT_DRIVER2.1 84.93,104.11 82.61,104.11 80.47,101.96 67.6,101.96 62.95,106.61 21.5,106.61 17.92,103.03 OUT_M2_KA.2
M2-
  Top 0.152: OUT_DRIVER2.2 79.93,104.28 76.18,104.28 73.5,106.97 19.17,106.97 15.24,103.03 OUT_M2_KA.1
M3+
  Bottom 0.152: OUT_DRIVER3.1 73.5,104.28 71.17,104.28 68.49,106.97 12.92,106.97 8.99,103.03 OUT_M3_KA.2
M3-
  Bottom 0.152: OUT_DRIVER3.2 68.49,104.28 64.74,104.28 62.42,106.61 14.53,106.61 9.52,101.6 7.74,101.6 6.48,102.86 OUT_M3_KA.1
M4+
  Top 0.152: OUT_DRIVER4.1 62.06,104.11 59.74,104.11 52.05,96.42 30.25,96.42 26.68,92.85 OUT_M4_KI.2
M4-
  Top 0.152: OUT_DRIVER4.2 57.06,104.11 53.3,104.11 45.98,96.78 28.11,96.78 24.18,92.85 OUT_M4_KI.1
M5+
  Bottom 0.152: OUT_DRIVER5.1 50.62,104.11 48.3,104.11 40.62,96.42 21.5,96.42 17.92,92.85 OUT_M5_KI.2
M5-
  Top 0.152: OUT_DRIVER5.2 45.62,104.11 41.87,104.11 34.9,97.14 19.53,97.14 15.24,92.85 OUT_M5_KI.1
M6+
  Top 0.152: OUT_DRIVER6.1 39.19,104.11 36.86,104.11 30.25,97.49 13.63,97.49 8.99,92.85 OUT_M6_KI.2
M6-
  Bottom 0.152: OUT_DRIVER6.2 34.18,104.11 29.72,104.11 22.39,96.78 10.42,96.78 6.48,92.85 OUT_M6_KI.1
N$2
  Top 0.152: S1.1 114.42,92.85 120.85,92.85 129.43,101.42 D1.A
N$3
  Top 0.152: D1.C 114.24,101.42 114.24,98.21 95.84,79.8 U$3.IN+
N$4
  Top 0.152: IN_DRIVER3.2 45.8,93.92 48.12,93.92 50.27,91.78 54.91,91.78 57.06,93.92 IN_DRIVER4.2 57.24,94.1 59.74,94.1 61.7,96.06 66.53,96.06 68.49,94.1 IN_DRIVER5.2 68.67,93.92 71,93.92 73.14,91.78 77.79,91.78 79.93,93.92 IN_DRIVER6.2
  Bottom 0.152: IN_DRIVER2.2 34.36,94.1 36.86,94.1 38.83,96.06 43.66,96.06 45.62,94.1 IN_DRIVER3.2 | 99.05,86.41 131.93,86.41 BATTERY.2 | 99.05,86.41 91.55,93.92 IN_DRIVER.2 91.37,94.1 89.4,96.06 84.4,96.06 82.43,94.1 80.11,94.1 IN_DRIVER6.2 | 99.05,86.41 98.51,85.88 98.51,79.45 95.84,76.77 95.84,62.65 U$3.IN-
PWM1
  Bottom 0.152: DRIVER.7 33.83,30.48 35.08,31.73 64.03,31.73 87.62,55.32 87.62,56.39 86.9,57.11 79.93,57.11 78.86,56.04 MEGA.4
PWM2
  Top 0.152: DRIVER2.7 26.68,36.91 29.9,36.91 34.9,41.92 63.49,41.92 76.18,54.61 79.93,54.61 81.18,55.86 MEGA.5
PWM3
  Top 0.152: DRIVER3.7 26.68,44.42 55.27,44.42 67.96,57.11 82.61,57.11 83.68,56.04 MEGA.6
PWM4
  Bottom 0.152: DRIVER4.7 26.68,52.1 26.68,53 30.61,56.93 32.75,56.93 35.08,54.61 38.83,54.61 44.01,49.42 79.75,49.42 86.19,55.86 MEGA.7
PWM5
  Bottom 0.152: DRIVER5.7 26.5,58.54 26.5,63.9 25.61,64.79 25.61,67.29 28.46,70.15 43.66,70.15 44.55,71.05 44.55,73.91 45.26,74.62 71.17,74.62 89.76,56.04 90.29,56.04 MEGA.8
PWM6
  Bottom 0.152: DRIVER6.7 26.68,65.86 49.91,65.86 58.66,57.11 65.46,57.11 67.96,54.61 76.71,54.61 77.43,55.32 77.43,56.39 78.5,57.47 87.08,57.47 89.94,54.61 91.55,54.61 92.8,55.86 MEGA.9
RX
  Top 0.152: GPS_NEO.4 85.65,71.05 80.47,71.05 64.03,54.61 52.05,54.61 50.8,55.86 MEGA.19
SCL
  Top 0.152: 31.15,70.51 32.93,72.3 IMU.SCL | 31.15,70.51 30.79,70.15 27.57,70.15 18.46,79.27 8.99,79.27 KOMPAS.SCL | 31.15,70.51 45.62,56.04 MEGA.21
SDA
  Top 0.152: MEGA.20 48.12,56.04 48.12,59.79 35.61,72.3 IMU.SDA
  Bottom 0.152: KOMPAS.SDA 8.99,76.77 31.32,76.77 35.61,72.48 IMU.SDA
TRIG1  (via drill 0.35)
  Top 0.152: v31.32,16.54 36.15,16.54 36.86,17.26 36.86,18.33 37.58,19.05 38.65,19.05 39.72,20.12 39.72,35.66 38.12,37.27 38.12,37.99 MEGA.34 | v28.64,16.54 26.5,16.54 24.71,14.76 15.24,14.76 13.1,16.9 v13.1,23.33
  Bottom 0.152: v28.64,16.54 v31.32,16.54 | v13.1,23.33 13.1,24.23 4.34,32.98 3.27,32.98 2.55,33.7 2.55,46.92 3.8,48.17 US_1.3
TRIG2  (via drill 0.35)
  Top 0.152: v18.1,7.61 7.02,7.61 2.55,12.08 2.55,32.27 3.8,33.52 3.8,34.23 US_2.3 | v34.01,17.97 35.08,19.05 36.15,19.05 36.86,19.76 36.86,20.83 37.58,21.55 38.65,21.55 39.37,22.26 39.37,34.23 38.12,35.48 MEGA.36
  Bottom 0.152: v18.1,7.61 22.75,12.25 22.75,12.43 24.35,14.04 30.07,14.04 v34.01,17.97
TRIG3  (via drill 0.35)
  Top 0.152: v39.54,51.57 39.54,53.71 38.65,54.61 37.58,54.61 36.86,55.32 36.86,56.39 29.18,64.08 11.13,64.08 v9.88,65.33
  Bottom 0.152: v39.54,51.57 39.54,35.13 38.12,33.7 38.12,33.16 MEGA.38 | v9.88,65.33 7.02,65.33 3.98,62.29 US_3.3
TX
  Top 0.152: GPS_NEO.3 85.65,73.55 71,73.55 53.48,56.04 MEGA.18
VCC
  Top 0.152: 11.49,11.36 15.06,11.36 ECR4.1 15.24,11.36 24,11.36 ECR5.1 | 11.49,11.36 7.74,11.36 ECR3.1 | 11.49,24.05 15.06,24.05 ECR1.1 15.24,24.05 24,24.05 ECR.1 | 11.49,24.05 7.74,24.05 ECR2.1 | 11.49,24.05 11.49,11.36